# EAGLE design trans-emu-soic8 (EAGLE 9.6.2)
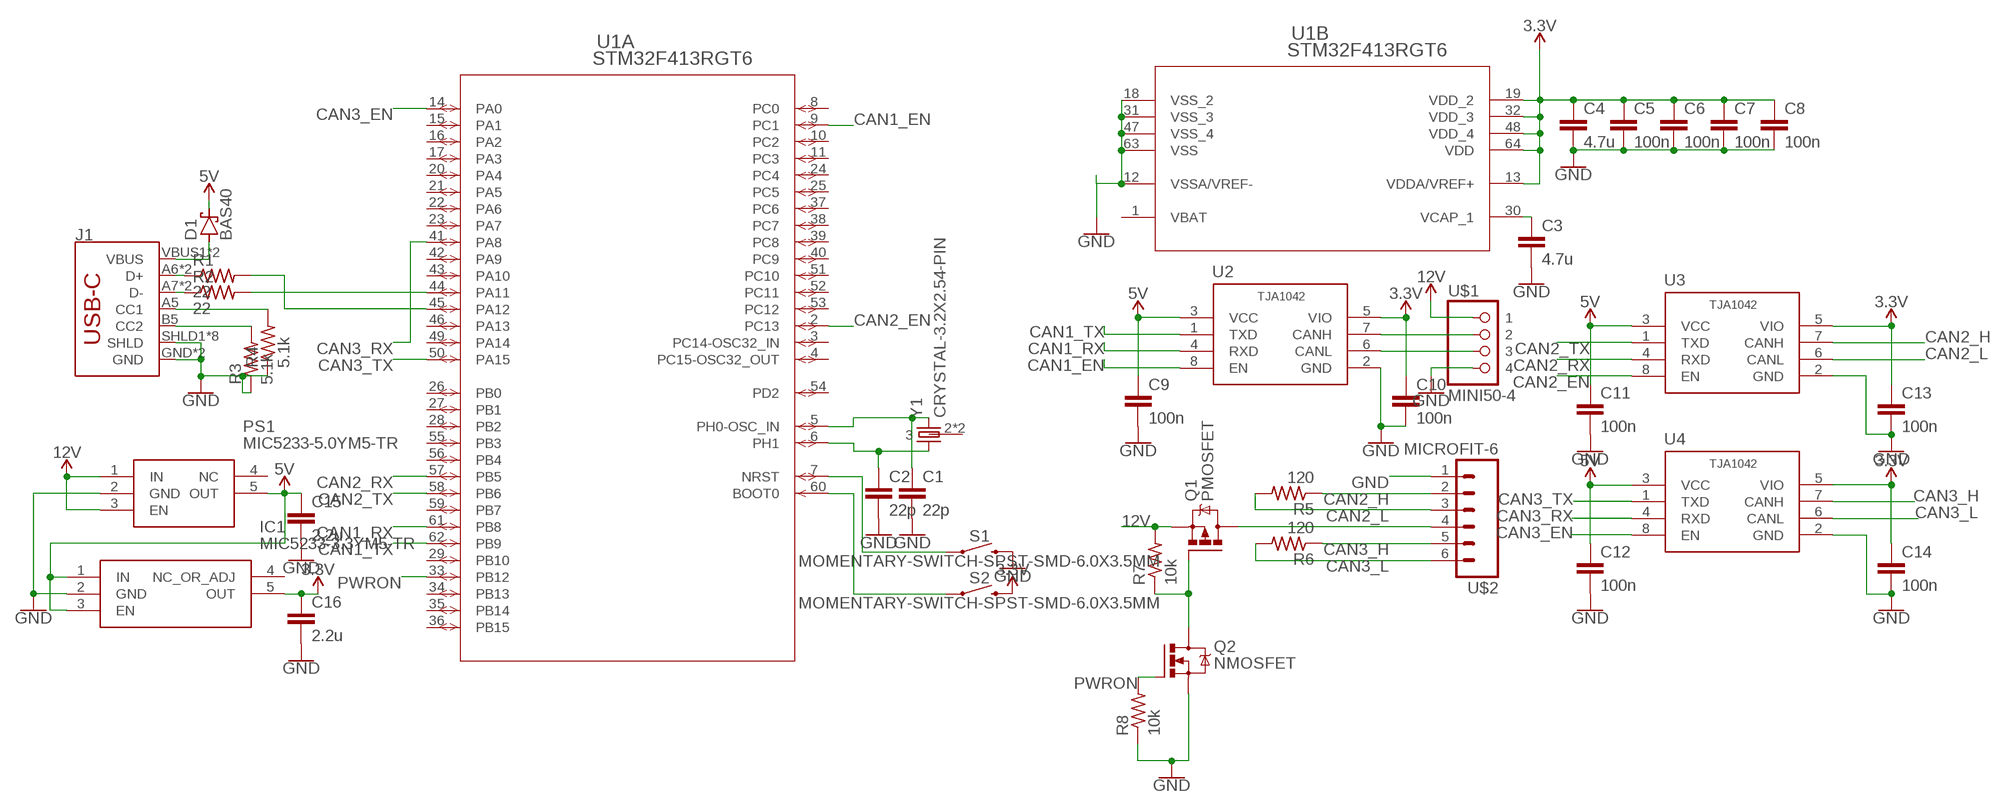
[diagram p0: schematic, sheet 1]

## Parts
C1  22p  C0603  [0603-C]
C2  22p  C0603  [0603-C]
C3  4.7u  C0603  [0603-C]
C4  4.7u  C0603  [0603-C]
C5  100n  C0603  [0603-C]
C6  100n  C0603  [0603-C]
C7  100n  C0603  [0603-C]
C8  100n  C0603  [0603-C]
C9  100n  C0603  [0603-C]
C10  100n  C0603  [0603-C]
C11  100n  C0603  [0603-C]
C12  100n  C0603  [0603-C]
C13  100n  C0603  [0603-C]
C14  100n  C0603  [0603-C]
C15  2.2u  C0603  [0603-C]
C16  2.2u  C0603  [0603-C]
D1  BAS40  [SOT23]
IC1  MIC5233-3.3YM5-TR  [SOT95P280X145-5N]
J1  USB-C-BREAKOUT_SPARKFUN-CONNECTORS_USB_C16PIN  [USB-C-BREAKOUT_SPARKFUN-CONNECTORS_USB-C-16P]
PS1  MIC5233-5.0YM5-TR  [SOT95P280X145-5N]
Q1  PMOSFET  PMOSFET_SOT23  [SOT23]
Q2  NMOSFET  NMOSFETSOT23  [SOT23]
R1  22  R0402  [0402-R]
R2  22  R0402  [0402-R]
R3  5.1k  R0402  [0402-R]
R4  5.1k  R0402  [0402-R]
R5  120  R0402  [0402-R]
R6  120  R0402  [0402-R]
R7  10k  R0402  [0402-R]
R8  10k  R0402  [0402-R]
S1  MOMENTARY-SWITCH-SPST-SMD-6.0X3.5MM  [TACTILE_SWITCH_SMD_6.0X3.5MM]
S2  MOMENTARY-SWITCH-SPST-SMD-6.0X3.5MM  [TACTILE_SWITCH_SMD_6.0X3.5MM]
U1  STM32F413RGT6  [LQFP64-10X10MM]
U2  TJA1042  [NXP_SEMICONDUCTORS_TJA1042T-3-CM_118_0]
U3  TJA1042  [NXP_SEMICONDUCTORS_TJA1042T-3-CM_118_0]
U4  TJA1042  [NXP_SEMICONDUCTORS_TJA1042T-3-CM_118_0]
U$1  MINI50-4  [MINI50]
U$2  MICROFIT-6  [MICROFIT-6]
Y1  CRYSTAL-3.2X2.54-PIN  [XTAL-3.2X2.5]

## Nets
3.3V: C4.1 C5.1 C6.1 C7.1 C8.1 C10.1 C13.1 C14.1 C16.1 IC1.5(OUT) S2.2 U1.13(B:VDDA/VREF+) U1.19(B:VDD_2) U1.32(B:VDD_3) U1.48(B:VDD_4) U1.64(B:VDD) U2.5(VIO) U3.5(VIO) U4.5(VIO)
5V: C9.1 C11.1 C12.1 C15.1 D1.3(C) IC1.1(IN) IC1.3(EN) PS1.5(OUT) U2.3(VCC) U3.3(VCC) U4.3(VCC)
12V: PS1.1(IN) PS1.3(EN) Q1.2(S) R7.2 U$1.4
CAN1_EN: U1.9(A:PC1) U2.8(EN)
CAN1_RX: U1.61(A:PB8) U2.4(RXD)
CAN1_TX: U1.62(A:PB9) U2.1(TXD)
CAN2_EN: U1.2(A:PC13) U3.8(EN)
CAN2_H: R5.1 U3.7(CANH) U$2.2
CAN2_L: R5.2 U3.6(CANL) U$2.3
CAN2_RX: U1.57(A:PB5) U3.4(RXD)
CAN2_TX: U1.58(A:PB6) U3.1(TXD)
CAN3_EN: U1.14(A:PA0) U4.8(EN)
CAN3_H: R6.1 U4.7(CANH) U$2.5
CAN3_L: R6.2 U4.6(CANL) U$2.6
CAN3_RX: U1.41(A:PA8) U4.4(RXD)
CAN3_TX: U1.50(A:PA15) U4.1(TXD)
GND: C1.2 C2.2 C3.2 C4.2 C5.2 C6.2 C7.2 C8.2 C9.2 C10.2 C11.2 C12.2 C13.2 C14.2 C15.2 C16.2 IC1.2(GND) J1.GND J1.GND2(GND) J1.SHLD1(SHLD) J1.SHLD2(SHLD) J1.SHLD3(SHLD) J1.SHLD4(SHLD) J1.SHLD5(SHLD) J1.SHLD6(SHLD) J1.SHLD7(SHLD) J1.SHLD8(SHLD) PS1.2(GND) Q2.2(S) R3.1 R4.1 R8.1 S1.2 U1.12(B:VSSA/VREF-) U1.18(B:VSS_2) U1.31(B:VSS_3) U1.47(B:VSS_4) U1.63(B:VSS) U2.2(GND) U3.2(GND) U4.2(GND) U$1.1 U$2.1
N$1: C1.1 U1.5(A:PH0-OSC_IN) Y1.3
N$2: C2.1 U1.6(A:PH1) Y1.1
N$3: R2.2 U1.44(A:PA11)
N$4: R1.2 U1.45(A:PA12)
N$5: D1.1(A) J1.VBUS1(VBUS) J1.VBUS2(VBUS)
N$6: J1.A5(CC1) R4.2
N$7: J1.B5(CC2) R3.2
N$8: S1.1 U1.7(A:NRST)
N$9: S2.1 U1.60(A:BOOT0)
N$10: J1.A6(D+) J1.B6(D+) R1.1
N$11: J1.A7(D-) J1.B7(D-) R2.1
N$12: U2.7(CANH) U$1.3
N$13: C3.1 U1.30(B:VCAP_1)
N$14: U2.6(CANL) U$1.2
N$15: Q1.3(D) U$2.4
N$16: Q1.1(G) Q2.3(D) R7.1
PWRON: Q2.1(G) R8.2 U1.33(A:PB12)
Unconnected: IC1.4(NC_OR_ADJ) PS1.4(NC) U1.3(A:PC14-OSC32_IN) U1.4(A:PC15-OSC32_OUT) U1.8(A:PC0) U1.10(A:PC2) U1.11(A:PC3) U1.15(A:PA1) U1.16(A:PA2) U1.17(A:PA3) U1.20(A:PA4) U1.21(A:PA5) U1.22(A:PA6) U1.23(A:PA7) U1.24(A:PC4) U1.25(A:PC5) U1.26(A:PB0) U1.27(A:PB1) U1.28(A:PB2) U1.29(A:PB10) U1.34(A:PB13) U1.35(A:PB14) U1.36(A:PB15) U1.37(A:PC6) U1.38(A:PC7) U1.39(A:PC8) U1.40(A:PC9) U1.42(A:PA9) U1.43(A:PA10) U1.46(A:PA13) U1.49(A:PA14) U1.51(A:PC10) U1.52(A:PC11) U1.53(A:PC12) U1.54(A:PD2) U1.55(A:PB3) U1.56(A:PB4) U1.59(A:PB7) Y1.2 Y1.4

## Power pins joined to a net without a drawn wire
VBAT: U1.1(B:VBAT)

## Library data of the parts
C1-C16 = comma.ai:C
D1 = diode:BAS40: Silicon Schottky Diodes General-purpose diode for high-speed switching
IC1 = SamacSys_Parts:MIC5233-3.3YM5-TR: High Input Voltage Low IQ UCAP LDO Regulator Source: Datasheet <http://ww1.microchip.com/downloads/en/DeviceDoc/MIC5233-Data-Sheet-DS20006033D.pdf>; DESCRIPTION: High Input Voltage Low IQ UCAP LDO Regulator; HEIGHT: 1.45mm; MANUFACTURER_NAME: Microchip; MANUFACTURER_PART_NUMBER: MIC5233-3.3YM5-TR; MOUSER_PART_NUMBER: 998-MIC5233-3.3YM5TR; MOUSER_PRICE-STOCK: https://www.mouser.co.uk/ProductDetail/Microchip-Technology-Micrel/MIC5233-33YM5-TR?qs=U6T8BxXiZAWDhshLMgpaLQ%3D%3D
J1 = ROTR-Wireless:USB-C-BREAKOUT_SPARKFUN-CONNECTORS_USB_C: USB Type C 16Pin Connector Super Speed pins not available on the 16-pin purely SMD connector so this part is best for USB 2.0 implementations. D1 and D2 are tied together enabling D+/- no matter which way the cable is plugged into the connector. The two channel configuration pins (CC1/2) are exposed. These are normally connected to ground via 5.1k resistors but can be reconfigured for high current/high power applications.; PROD_ID: CONN-14122
PS1 = SamacSys_Parts:MIC5233-5.0YM5-TR: MICROCHIP - MIC5233-5.0YM5-TR - LDO, REG, 36VIN, 0.1A, 5V, 2%, 5SOT23 Source: Datasheet <https://componentsearchengine.com/Datasheets/2/MIC5233-5.0YM5-TR.pdf>; DESCRIPTION: MICROCHIP - MIC5233-5.0YM5-TR - LDO, REG, 36VIN, 0.1A, 5V, 2%, 5SOT23; HEIGHT: 1.45mm; MANUFACTURER_NAME: Microchip; MANUFACTURER_PART_NUMBER: MIC5233-5.0YM5-TR; MOUSER_PART_NUMBER: 998-MIC5233-5.0YM5TR; MOUSER_PRICE-STOCK: https://www.mouser.co.uk/ProductDetail/Microchip-Technology-Micrel/MIC5233-50YM5-TR?qs=U6T8BxXiZAWSnpCHgrMajw%3D%3D
Q1 = Transistor:PMOSFET: P-Channel MOSFET - Generic; CATEGORY: Transistor; SUB-CATEGORY: MOSFET; TYPE: P-Channel
Q2 = Transistor:NMOSFET: N-Channel MOSFET - Generic; CATEGORY: Transistor; SUB-CATEGORY: MOSFET; TYPE: N-Channel
R1-R8 = comma.ai:R
S1 S2 = SparkFun-Switches:MOMENTARY-SWITCH-SPST: Momentary Switch (Pushbutton) - SPST Normally-open (NO) SPST momentary switches (buttons, pushbuttons). Variants PTH-12MM - 12mm square, through-hole Momentary Pushbutton Switch - 12mm Square <https://www.sparkfun.com/products/9190> (COM-09190) PTH-6.0MM, PTH-6.0MM-KIT - 6.0mm square, through-hole Mini Pushbutton Switch <https://www.sparkfun.com/products/97> (COM-00097) KIT package intended for soldering kit's - only one side of pads' copper is exposed. PTH-RIGHT-ANGLE-KIT - Right-angle, through-hole Right Angle Tactile Button <https://www.sparkfun.com/products/10791> - Used on SparkFun BigTime Watch Kit <https://www.sparkfun.com/products/11734> SMD-12MM - 12mm square, surface-mount Tactile Button - SMD (12mm) <https://www.sparkfun.com/products/12993> (COM-12993) Used on SparkFun PicoBoard <https://www.sparkfun.com/products/11888> SMD-4.5MM - 4.5mm Square Trackball Switch Used on SparkFun Blackberry Trackballer Breakout <https://www.sparkfun.com/products/13169> SMD-4.6MMX2.8MM - 4.60mm x 2.80mm, surface mount Used on SparkFun SAMD21 Mini Breakout <https://www.sparkfun.com/products/13664> SMD-5.2MM, SMD-5.2-REDUNDANT - 5.2mm square, surface-mount Mini Pushbutton Switch - SMD <https://www.sparkfun.com/products/8720> (COM-08720) Used on Arduino Pro Mini <https://www.sparkfun.com/products/11114> REDUNDANT package connects both switch circuits together SMD-6.0X3.5MM - 6.0 x 3.5mm, surface mount Momentary Reset Switch SMD <https://www.sparkfun.com/products/8229> (COM-08229) SMD-6.2MM-TALL - 6.2mm square, surface mount Tactile Button - SMD (6mm) <https://www.sparkfun.com/products/12992> Used on SparkFun Digital Sandbox <https://www.sparkfun.com/products/12651> SMD-RIGHT-ANGLE - Right-angle, surface mount Used on SparkFun Block for Intel® Edison - Arduino <https://www.sparkfun.com/products/13036>; PROD_ID: SWCH-00815; SF_SKU: COM-08229
U1 = interceptor:STM32F413RGT6; BUILT_BY: EMA_UL_Team; COPYRIGHT: Copyright (C) 2018 Accelerated Designs. All rights reserved; MANUFACTURER_PART_NUMBER: STM32F413RGT6; SOURCELIBRARY: Updates_to_database_2020-10-19; VENDOR: STMicroelectronics
U2-U4 = CM,118:TJA1042
U$1 = interceptor:MINI50-4
U$2 = interceptor:MICROFIT-6
Y1 = comma.ai:CRYSTAL-3.2X2.5

## Board
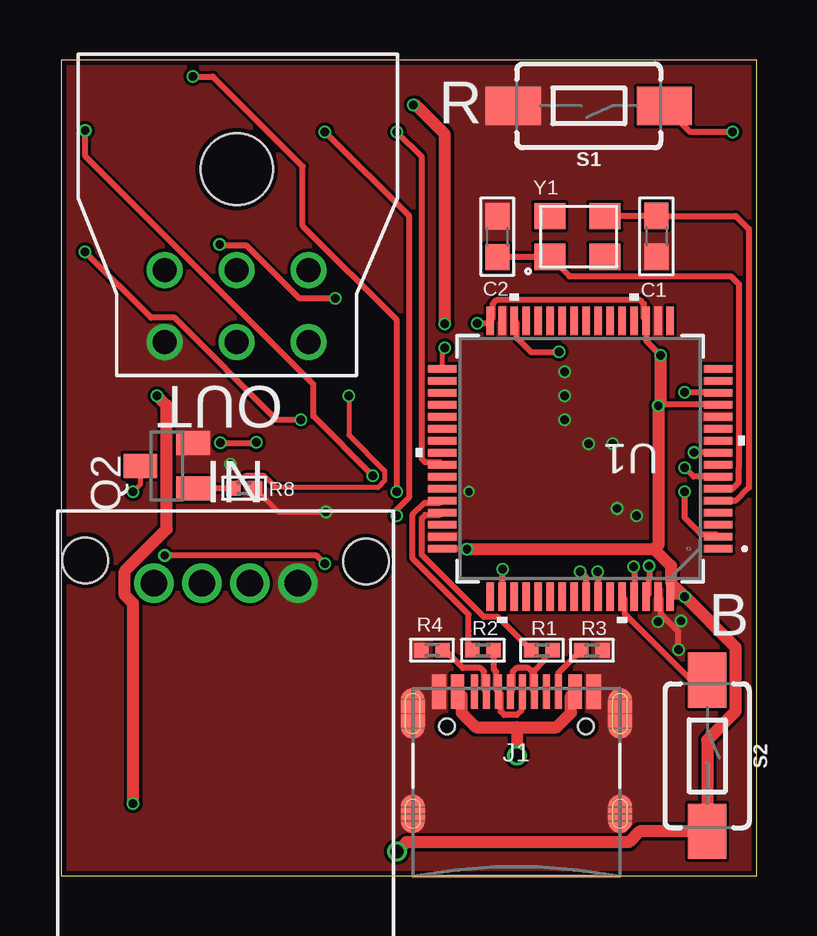
[diagram p1: board, top side]
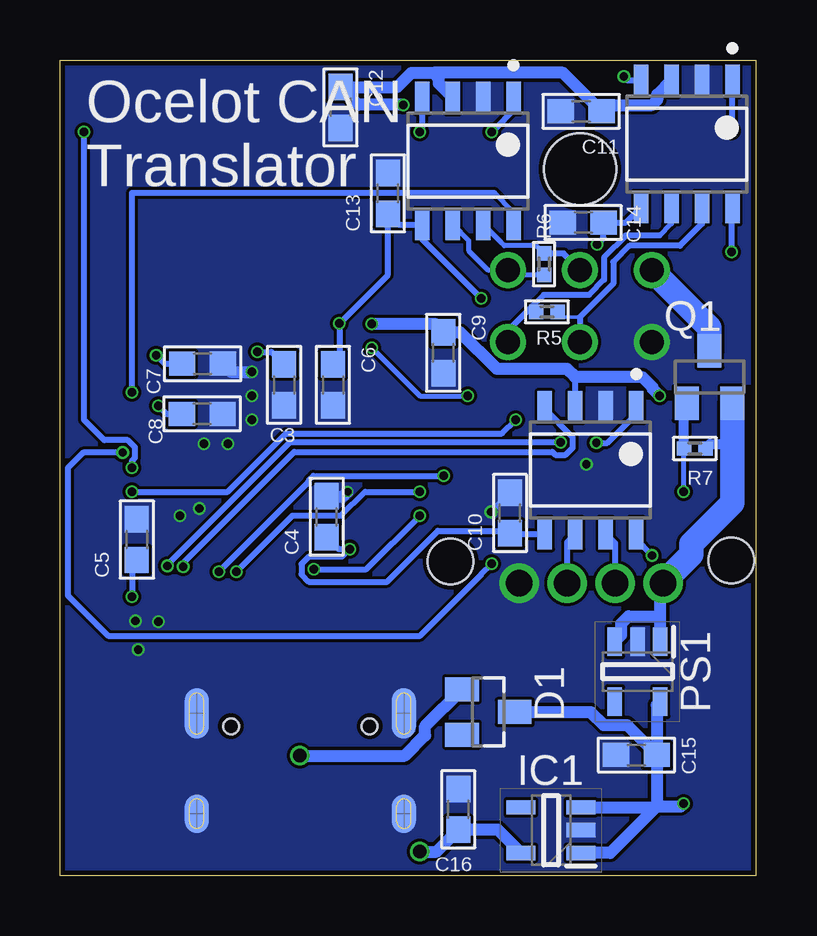
[diagram p2: board, bottom side, seen from below]

Size 29 x 34 mm. Coordinates in mm from the lower left corner, seen from the top.
Outline: 0,0 29,0 29,34 0,34 0,0
Copper layers (1*16): Top 0.035559375mm / dielectric 1.6mm / Bottom 0.035559375mm
Design rules "jlcpcb2layer": minimum track width 5mil, minimum drill 12mil, track to track 5mil, track to pad 5mil, pad to pad 5mil, via to via 5mil, smd to smd 5mil, copper to edge 8mil, drill to drill 6mil, minimum pad ring 5mil, minimum via ring 3mil, stop-mask expansion 2.5mil, vias tented up to drill 0mil, thermal gap 10mil

### Footprints (pad centres in the part's own frame; a part is rotated, then mirrored left to right if it is on the bottom)
0603-C = smd 1.1 x 1: 1 -0.85,0; 2 0.85,0
SOT23 = smd 1 x 1.4: 1 -0.95,-1.1; 2 0.95,-1.1; 3 0,1.1
SOT95P280X145-5N = smd 1.2 x 0.6: 1 -1.25,0.95; 2 -1.25,0; 3 -1.25,-0.95; 4 1.25,-0.95; 5 1.25,0.95
USB-C-BREAKOUT_SPARKFUN-CONNECTORS_USB-C-16P = smd 0.3 x 1.45: A5 -1.25,0; A6 -0.25,0; A7 0.25,0; A8 1.25,0; B5 1.75,0; B6 0.75,0; B7 -0.75,0; B8 -1.75,0 | smd 0.6 x 1.45: GND -3.225,0; GND2 3.225,0 | smd 1 x 2.1: SHLD1 -4.32,-0.915; SHLD2 4.32,-0.915 | smd 1 x 2.1 bottom: SHLD3 -4.32,-0.915; SHLD4 4.32,-0.915 | smd 1 x 1.6: SHLD5 -4.32,-5.095; SHLD8 4.32,-5.095 | smd 1 x 1.6 bottom: SHLD6 -4.32,-5.095; SHLD7 4.32,-5.095 | smd 0.55 x 1.45: VBUS1 -2.45,0; VBUS2 2.45,0 | hole 0.65: -2.89,-1.445; 2.89,-1.445
0402-R = smd 0.6 x 0.6: 1 -0.45,0; 2 0.45,0
TACTILE_SWITCH_SMD_6.0X3.5MM = smd 2.3 x 1.6: 1 -3.15,0; 2 3.15,0
LQFP64-10X10MM = smd 1.194 x 0.305: 1 -5.75,3.75; 2 -5.75,3.25; 3 -5.75,2.75; 4 -5.75,2.25; 5 -5.75,1.75; 6 -5.75,1.25; 7 -5.75,0.75; 8 -5.75,0.25; 9 -5.75,-0.25; 10 -5.75,-0.75; 11 -5.75,-1.25; 12 -5.75,-1.75; 13 -5.75,-2.25; 14 -5.75,-2.75; 15 -5.75,-3.25; 16 -5.75,-3.75; 33 5.75,-3.75; 34 5.75,-3.25; 35 5.75,-2.75; 36 5.75,-2.25; 37 5.75,-1.75; 38 5.75,-1.25; 39 5.75,-0.75; 40 5.75,-0.25; 41 5.75,0.25; 42 5.75,0.75; 43 5.75,1.25; 44 5.75,1.75; 45 5.75,2.25; 46 5.75,2.75; 47 5.75,3.25; 48 5.75,3.75 | smd 0.305 x 1.194: 17 -3.75,-5.75; 18 -3.25,-5.75; 19 -2.75,-5.75; 20 -2.25,-5.75; 21 -1.75,-5.75; 22 -1.25,-5.75; 23 -0.75,-5.75; 24 -0.25,-5.75; 25 0.25,-5.75; 26 0.75,-5.75; 27 1.25,-5.75; 28 1.75,-5.75; 29 2.25,-5.75; 30 2.75,-5.75; 31 3.25,-5.75; 32 3.75,-5.75; 49 3.75,5.75; 50 3.25,5.75; 51 2.75,5.75; 52 2.25,5.75; 53 1.75,5.75; 54 1.25,5.75; 55 0.75,5.75; 56 0.25,5.75; 57 -0.25,5.75; 58 -0.75,5.75; 59 -1.25,5.75; 60 -1.75,5.75; 61 -2.25,5.75; 62 -2.75,5.75; 63 -3.25,5.75; 64 -3.75,5.75
NXP_SEMICONDUCTORS_TJA1042T-3-CM_118_0 = smd 1.3 x 0.6: 1 -2.65,1.905; 2 -2.65,0.635; 3 -2.65,-0.635; 4 -2.65,-1.905; 5 2.65,-1.905; 6 2.65,-0.635; 7 2.65,0.635; 8 2.65,1.905
MINI50 = drill 1.1: 1 0,0; 2 2,0; 3 4,0; 4 6,0 | hole 1.9: -2.85,-0.9; 8.85,-0.95
MICROFIT-6 = drill 1: 1 3,0; 2 0,0; 3 -3,0; 4 3,-3; 5 0,-3; 6 -3,-3 | hole 3: 0,-7.2
XTAL-3.2X2.5 = smd 1.3 x 1.1: 1 0,-1.8; 2 2.3,-1.8; 3 2.3,-0.1; 4 0,-0.1

### Placement (x,y rotation side)
C1  24.81,26.65 270 top
C2  18.18,26.63 90 top
C3  19.65,20.45 270 bottom
C4  17.88,14.96 90 bottom
C5  25.79,14.01 90 bottom
C6  17.62,20.45 270 bottom
C7  23.06,21.33 0 bottom
C8  23.07,19.25 0 bottom
C9  13.02,21.79 270 bottom
C10  10.24,15.11 90 bottom
C11  7.27,31.86 180 bottom
C12  17.31,32.02 270 bottom
C13  15.33,28.44 90 bottom
C14  7.19,27.23 180 bottom
C15  4.96,5.03 180 bottom
C16  12.39,2.76 90 bottom
D1  11.14,6.82 270 bottom
IC1  8.53,1.89 180 bottom
J1  18.98,7.67 0 top
PS1  4.92,8.5 270 bottom
Q1  1.92,20.78 0 bottom
Q2  4.4,17.08 90 top
R1  20.05,9.39 180 top
R2  17.59,9.39 180 top
R3  22.13,9.39 180 top
R4  15.46,9.4 0 top
R5  8.7,23.5 180 bottom
R6  8.82,25.49 270 bottom
R7  2.53,17.8 0 bottom
R8  7.63,16.14 180 top
S1  22,32.09 180 top
S2  26.93,4.99 270 top
U1  21.64,17.38 180 top
U2  6.88,16.9 270 bottom
U3  2.87,30.5 270 bottom
U4  11.99,29.79 270 bottom
U$1  9.86,12.19 180 top
U$2  7.32,22.25 180 top
Y1  20.37,27.59 0 top

### Tracks (layer width: path | path; a pad name or v marks a point on that pad's centre or on a via)
3.3V  (via drill 0.35, 0.55)
  Top 0.254: U1.64 v26,11.63 | v17.35,23.02 17.78,23.02 U1.32 17.98,23.22 17.98,23.83 18.13,23.98 24.15,23.98 24.3,23.83 24.3,23.22 U1.19 24.39,22.29 v24.99,21.69 | U1.13 24.94,19.63 v24.9,19.59 | v16.92,13.61 15.91,13.61 U1.48 | v6.61,26.31 6.66,26.25 7.74,26.25 9.93,24.06 v11.43,24.06
  Top 0.508: v16.92,13.61 24.72,13.61 | 24.72,13.61 25.42,12.91 25.42,12.21 v26,11.63 28.11,9.52 28.11,6.83 26.93,5.65 S2.2 24.11,1.84 23.66,1.39 14.39,1.39 v14,1 | 24.72,13.61 24.9,13.79 v24.9,19.59 24.99,19.68 v24.99,21.69
  Bottom 0.254: C6.1 17.35,21.57 v17.35,23.02 15.33,25.04 C13.1 14.88,27.14 U4.5 13.89,26.52 v11.43,24.06 | v24.99,21.69 24.63,21.33 C7.1 | v24.9,19.59 24.56,19.25 C8.1 | C5.1 26,12.95 v26,11.63 | C4.1 17.39,13.61 v16.92,13.61 17.25,13.28 18.63,13.28 18.93,12.98 18.93,12.55 18.63,12.25 15.36,12.25 13.24,14.37 10.34,14.37 C10.1 10.22,14.25 U2.5 | v6.61,26.31 6.34,26.58 C14.1 5.4,27.23 U3.5
  Bottom 0.508: IC1.5 10.74,1.91 C16.1 13.3,1 v14,1
5V  (via drill 0.35)
  Top 0.508: v3,3 3,11.34 2.65,11.69 2.65,12.69 4.4,14.44 4.4,19.6 v4,20 | v16,23 16,30.9 14.77,32.13 v14.68,32.13
  Bottom 0.254: U2.3 7.52,20.78
  Bottom 0.508: PS1.5 4.12,7.11 C15.1 | C15.1 4.12,2.88 | IC1.1 6.06,0.94 4.16,2.84 | IC1.3 4.16,2.84 | 4.16,2.84 4.12,2.88 | D1.3 6.88,6.82 6.33,6.27 5.36,6.27 C15.1 | 4.12,2.88 3.12,2.88 v3,3 | v4,20 4.3,20.3 4.3,20.35 4.72,20.78 7.52,20.78 7.86,21.12 10.79,21.12 12.31,22.64 C9.1 13.38,23 v16,23 | v14.68,32.13 16.56,32.13 C12.1 14.95,32.87 14.35,33.47 13.44,33.47 | 13.44,33.47 13.21,33.24 13.21,33.03 U4.3 | U3.3 4.1,32.56 4.1,32.34 4.32,32.12 6.17,32.12 C11.1 8.03,33.47 13.44,33.47
12V
  Bottom 0.254: 3.97,12.08 U$1.4
  Bottom 0.406: R7.2 1.89,18 0.97,18
  Bottom 0.508: PS1.1 3.97,10.81 | 3.97,10.81 3.97,12.08 | PS1.3 5.6,10.02 5.6,10.51 5.3,10.81 3.97,10.81
  Bottom 1.016: U$1.4 2.67,13.38 2.67,13.83 0.97,15.53 0.97,18 Q1.2 | Q1.2
CAN1_EN  (via drill 0.35)
  Top 0.254: U1.9 v26.39,17.63 v26.39,17.64 | v11,13 10.66,13.34 v4.32,13.34
  Bottom 0.254: v26.39,17.64 28.04,17.64 28.67,17 28.67,11.67 27,10 13.99,10 11.43,12.56 11.43,12.57 v11,13 | v4.32,13.34 4.98,14 U2.8
CAN1_RX  (via drill 0.35)
  Top 0.254: v23.86,12.88 23.89,12.85 U1.61
  Bottom 0.254: v23.86,12.88 23.86,13.04 19.24,17.67 8.48,17.67 8.35,17.54 7.92,17.54 7.62,17.84 7.62,18.27 8.79,19.44 U2.4
CAN1_TX  (via drill 0.35)
  Top 0.254: v6.63,18.03 8.11,18.03 v8.13,18.05 | v24.52,12.91 24.52,12.36 24.48,12.33 24.48,11.72 U1.62
  Bottom 0.254: U2.1 4.98,19.24 6.18,18.03 v6.63,18.03 | v24.52,12.91 24.38,13.04 24.38,13.09 19.42,18.05 v8.13,18.05
CAN2_EN  (via drill 0.35)
  Top 0.254: U1.2 27.3,14.22 26.69,14.22 26,14.91 v26,16 | v1,26 3.75,23.25 4.74,23.25 8.99,19 v10,19
  Bottom 0.254: v26,16 22.01,16 19.57,18.43 10.56,18.43 v10,19 | U3.8 1,27.89 v1,26
CAN2_H
  Bottom 0.152: R5.1 8.04,23.29 7.32,23.29
  Bottom 0.254: U3.7 2.24,27.18 3.15,26.26 5.25,26.26 5.93,25.57 5.93,24.68 7.32,23.29 U$2.2
CAN2_L
  Bottom 0.152: R5.2 9.32,23.67 9.37,23.67
  Bottom 0.2: 4,26.68 3.51,27.17 U3.6
  Bottom 0.254: 4,26.68 5.42,26.68 6.32,25.78 6.32,24.83 6.94,24.21 8.83,24.21 9.37,23.67 10.32,22.72 U$2.3
CAN2_RX  (via drill 0.35)
  Top 0.254: U1.57 21.89,12.42 v21.64,12.67 | v14,16 14,23.15 10.07,27.07 10.07,29.56 6.32,33.31 v5.49,33.31
  Bottom 0.254: v21.64,12.67 19.31,15 17.27,15 16.27,16 v14,16 | v5.49,33.31 5.32,33.15 U3.4
CAN2_TX  (via drill 0.35)
  Top 0.254: U1.58 22.39,12.65 v22.37,12.67 | v13,16.66 10.52,19.15 10.52,20.47 1,29.98 v1,31.06
  Bottom 0.254: v22.37,12.67 18.63,16.41 18.63,16.46 18.43,16.66 v13,16.66 | v1,31.06 0.97,31.09 U3.1
CAN3_EN  (via drill 0.35)
  Top 0.254: U1.14 26.02,20.13 v26,20.15
  Bottom 0.2: U4.8 10.08,27.65 10.89,28.46
  Bottom 0.254: v26,20.15 26,28.46 10.89,28.46
CAN3_H
  Bottom 0.152: 9,26.12 R6.1
  Bottom 0.203: U4.7 10.61,26.4 10.61,26.39 10.48,26.26 9.14,26.26 R6.1
  Bottom 0.254: U$2.5 8.01,25.94 R6.1
CAN3_L
  Bottom 0.2: U4.6 11.96,26.47 11.96,26.05 11.16,25.25 U$2.6
  Bottom 0.203: R6.2 10.11,25.04 U$2.6
CAN3_RX  (via drill 0.35)
  Top 0.254: U1.41 15.8,17.22 15.19,17.22 15.04,17.37 15.04,29.96 v14,31
  Bottom 0.254: v14,31 13.89,31.11 U4.4
CAN3_TX  (via drill 0.35)
  Top 0.254: U1.50 18.39,12.74 v18.41,12.77 | v14,15 14,15.27 14.52,15.79 14.52,27.48 v11,31
  Bottom 0.254: v18.41,12.77 16.23,12.77 v14,15 | U4.1 9.96,32.04 v11,31
GND  (via drill 0.3, 0.35)
  Top 0.203: R8.1 9.06,15.16 v11.03,15.16
  Top 0.254: U1.63 24.98,11.54 24.98,10.93 25.74,10.17 v25.74,9.42
  Bottom 0.203: v11.03,15.16 11.03,15.03 11,15
  Bottom 0.254: v11.03,15.16 C10.2
  Bottom 0.508: C7.2 21.87,21 v21,21 | C4.2 17.2,15.81 v17,16
  other vias: 21,20 21,19 22,18 23,18 24.89,10.58 24,15 23.19,15.3 25.85,10.61 7.05,17.15
  pour Bottom (no thermals): 0,34 29,34 29,0 0,0
  pour Top (no thermals): 0,0 0,34 29,34 29,0
N$1
  Top 0.254: Y1.3 22.68,27.5 C1.1 28.12,27.5 28.67,26.95 28.67,16.17 28.12,15.62 27.4,15.62 U1.5
N$2
  Top 0.254: C2.1 Y1.1 21.18,24.98 27.93,24.98 28.26,24.65 28.26,17 28.24,16.98 28.24,16.37 28,16.13 U1.6
N$3
  Top 0.254: R2.2 16.99,9.54 16.99,10 16.99,10.2 16.99,10.88 14.66,13.21 14.66,15.04 15.15,15.54 15.8,15.54 U1.44
N$4
  Top 0.254: R1.2 18.21,10.78 17.63,10.78 15.04,13.37 15.04,14.89 15.19,15.04 15.8,15.04 U1.45
N$5  (via drill 0.55)
  Top 0.508: J1.VBUS1 16.7,7.5 16.7,6.79 17.3,6.18 19,6.18 | J1.VBUS2 21.26,7.5 21.26,6.79 20.66,6.18 19,6.18 | 19,6.18 v19,5
  Bottom 0.508: D1.1 13.78,6.23 13.78,5.84 14.62,5 v19,5
N$6
  Top 0.254: R4.2 16,9.4 16.75,8.65 17.48,8.65 17.63,8.5 17.63,7.77 J1.A5
N$7
  Top 0.254: J1.B5 20.73,8.44 R3.2
N$8  (via drill 0.35)
  Top 0.254: U1.7 26.37,16.63 v26,17 | v28,31 26.23,31 S1.1
  Bottom 0.254: v26,17 26,17.29 25.87,17.42 25.87,17.85 26.17,18.15 27.15,18.15 28,19 v28,31
N$9
  Top 0.254: U1.60 23.48,11.54 23.48,10.93 26.27,8.14 S2.1
N$10
  Top 0.254: J1.A6 18.83,7.77 18.83,8.5 18.98,8.65 19.48,8.65 19.63,8.5 19.63,7.77 J1.B6 19.73,8.56 20.15,8.98 20.15,9.04 R1.1
N$11
  Top 0.254: J1.A7 19.21,7.65 19.21,6.91 18.98,6.69 18.48,6.69 18.33,6.84 18.33,7.57 J1.B7 18.13,7.77 18.13,8.5 18.04,8.59 R2.1
N$12
  Bottom 0.254: U2.7 5.86,13.86 U$1.3
N$13  (via drill 0.35)
  Top 0.254: U1.30 18.98,23.04 18.98,22.43 19.58,21.83 v20.77,21.83
  Bottom 0.254: v20.77,21.83 20.18,21.83 C3.1
N$14
  Bottom 0.254: U2.6 7.86,13.9 U$1.2
N$15
  Bottom 1.016: Q1.3 1.92,22.85 U$2.4
N$16  (via drill 0.35)
  Top 0.203: Q2.3 3.3,16.3 v3,16
  Bottom 0.203: v3,16 2.98,16.02 R7.1
  Bottom 0.406: R7.1 2.98,19.57 Q1.1
PWRON  (via drill 0.35)
  Top 0.203: 7.16,16.13 7.13,16.13 7.68,16.67 8.47,16.67 8.97,16.17 13.2,16.17 13.49,16.46 13.49,16.87 12,18.36 v12,20 | U1.33 15.89,21.89 v16,22
  Top 0.254: R8.2 7.16,16.13 Q2.1
  Bottom 0.203: v16,22 14,20 v12,20

### Text on the board
tNames: R | OUT | IN | B
bNames: Ocelot CAN / Translator